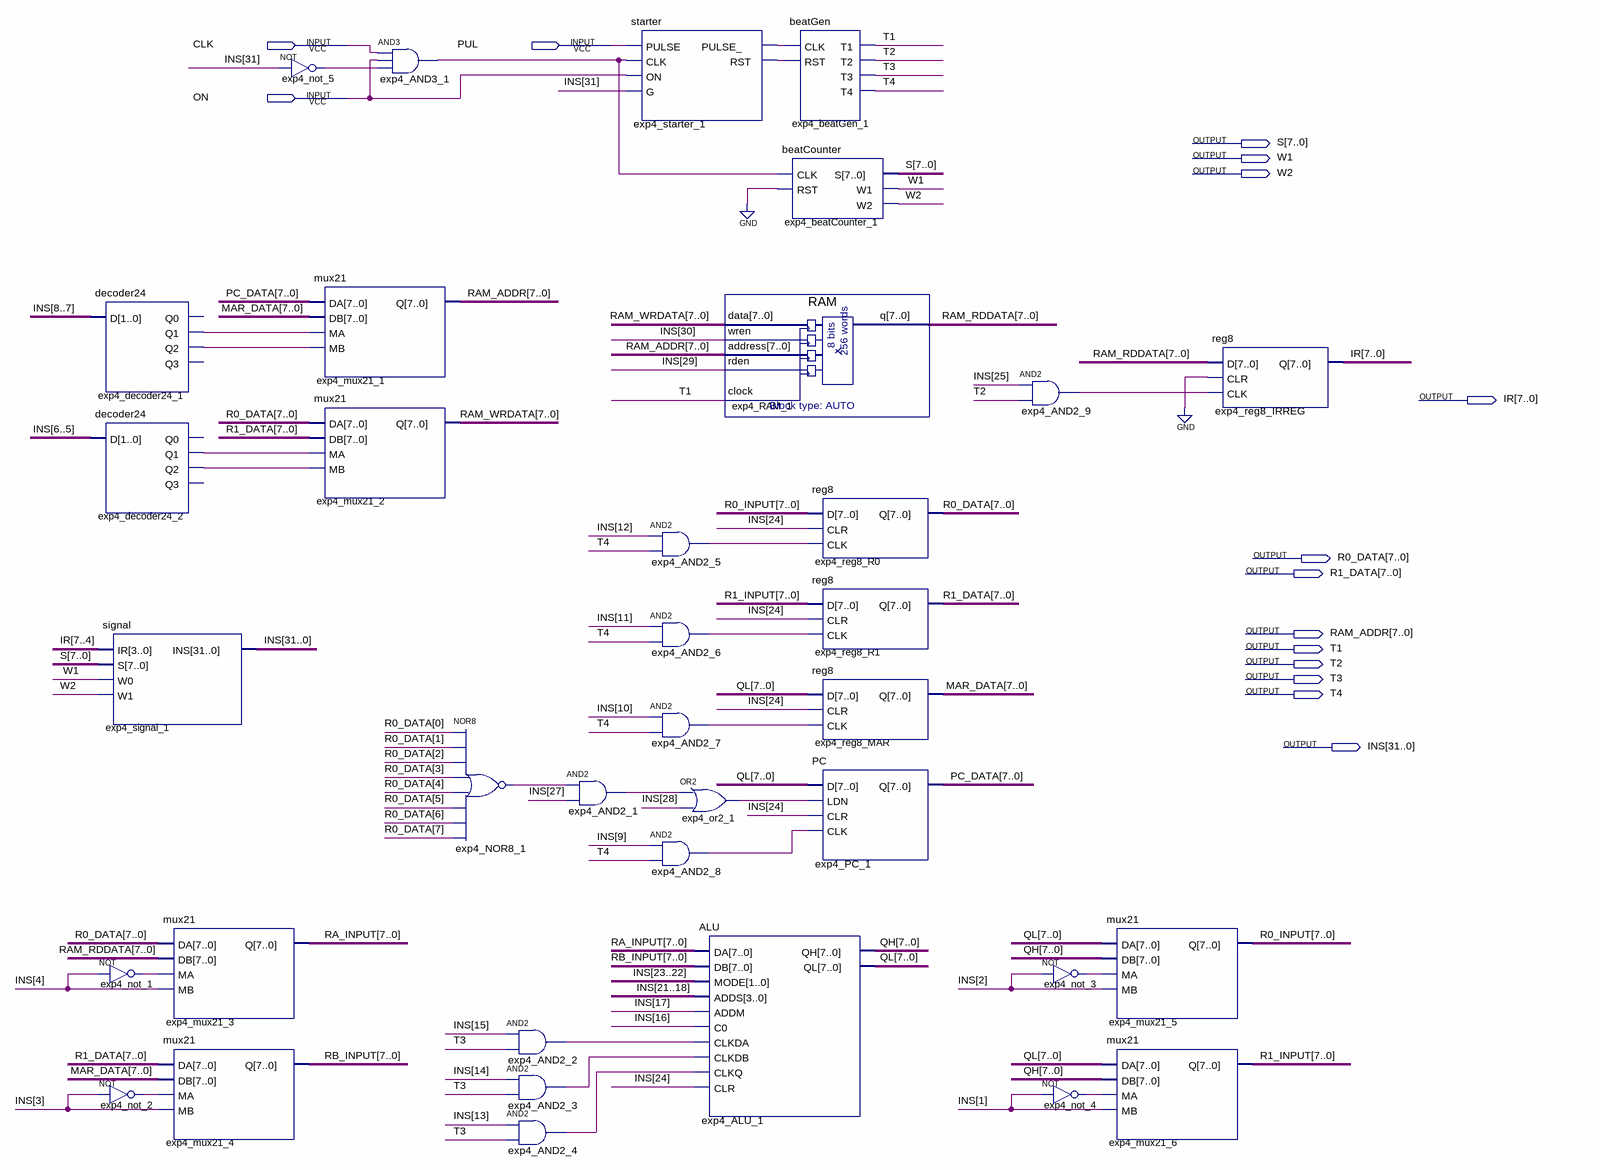
[diagram p0: schematic sheet]
// Quartus schematic exp4.bdf as structural Verilog: 36 symbols, 15 pins
module exp4 (
  input  CLK,
  input  PUL,
  input  ON,
  output [7:0] S,
  output W1,
  output W2,
  output [7:0] IR,
  output [7:0] R0_DATA,
  output [7:0] R1_DATA,
  output [7:0] RAM_ADDR,
  output T1,
  output T2,
  output T3,
  output T4,
  output [31:0] INS
);

  wire exp4_AND2_1_out, exp4_AND2_2_out, exp4_AND2_3_out, exp4_AND2_4_out, exp4_AND2_5_out, exp4_AND2_6_out,
       exp4_AND2_7_out, exp4_AND2_8_out, exp4_AND2_9_out, exp4_AND3_1_out, exp4_decoder24_1_q1,
       exp4_decoder24_1_q2, exp4_decoder24_2_q1, exp4_decoder24_2_q2, exp4_NOR8_1_out, exp4_not_1_out,
       exp4_not_2_out, exp4_not_3_out, exp4_not_4_out, exp4_not_5_out, exp4_or2_1_out, exp4_starter_1_pulse_,
       exp4_starter_1_rst;
  wire [7:0] MAR_DATA, PC_DATA, QH, QL, R0_INPUT, R1_INPUT, RA_INPUT, RAM_RDDATA, RAM_WRDATA, RB_INPUT;

  decoder24 exp4_decoder24_1 (.D(INS[8:7]), .Q1(exp4_decoder24_1_q1), .Q2(exp4_decoder24_1_q2));  // open: Q0, Q3
  decoder24 exp4_decoder24_2 (.D(INS[6:5]), .Q1(exp4_decoder24_2_q1), .Q2(exp4_decoder24_2_q2));  // open: Q0, Q3
  signal exp4_signal_1 (.IR(IR[7:4]), .S(S), .W0(W1), .W1(W2), .INS(INS));
  not exp4_not_1 (exp4_not_1_out, INS[4]);
  not exp4_not_2 (exp4_not_2_out, INS[3]);
  mux21 exp4_mux21_3 (.DA(R0_DATA), .DB(RAM_RDDATA), .MA(exp4_not_1_out), .MB(INS[4]), .Q(RA_INPUT));
  mux21 exp4_mux21_4 (.DA(R1_DATA), .DB(MAR_DATA), .MA(exp4_not_2_out), .MB(INS[3]), .Q(RB_INPUT));
  not exp4_not_5 (exp4_not_5_out, INS[31]);
  mux21 exp4_mux21_1 (.DA(PC_DATA), .DB(MAR_DATA), .MA(exp4_decoder24_1_q1), .MB(exp4_decoder24_1_q2), .Q(RAM_ADDR));
  mux21 exp4_mux21_2 (.DA(R0_DATA), .DB(R1_DATA), .MA(exp4_decoder24_2_q1), .MB(exp4_decoder24_2_q2), .Q(RAM_WRDATA));
  and exp4_AND3_1 (exp4_AND3_1_out, CLK, ON, exp4_not_5_out);
  nor exp4_NOR8_1 (exp4_NOR8_1_out, R0_DATA[0], R0_DATA[1], R0_DATA[2], R0_DATA[3], R0_DATA[4], R0_DATA[5], R0_DATA[6], R0_DATA[7]);
  and exp4_AND2_2 (exp4_AND2_2_out, INS[15], T3);
  and exp4_AND2_3 (exp4_AND2_3_out, INS[14], T3);
  and exp4_AND2_4 (exp4_AND2_4_out, INS[13], T3);
  and exp4_AND2_1 (exp4_AND2_1_out, exp4_NOR8_1_out, INS[27]);
  starter exp4_starter_1 (
    .PULSE(PUL), .CLK(exp4_AND3_1_out), .ON(ON), .G(INS[31]), .PULSE_(exp4_starter_1_pulse_),
    .RST(exp4_starter_1_rst));
  and exp4_AND2_5 (exp4_AND2_5_out, INS[12], T4);
  and exp4_AND2_6 (exp4_AND2_6_out, INS[11], T4);
  and exp4_AND2_7 (exp4_AND2_7_out, INS[10], T4);
  or exp4_or2_1 (exp4_or2_1_out, exp4_AND2_1_out, INS[28]);
  and exp4_AND2_8 (exp4_AND2_8_out, INS[9], T4);
  RAM exp4_RAM_1 (.data(RAM_WRDATA), .wren(INS[30]), .address(RAM_ADDR), .rden(INS[29]), .clock(T1), .q(RAM_RDDATA));
  ALU exp4_ALU_1 (
    .DA(RA_INPUT), .DB(RB_INPUT), .MODE(INS[23:22]), .ADDS(INS[21:18]), .ADDM(INS[17]), .C0(INS[16]),
    .CLKDA(exp4_AND2_2_out), .CLKDB(exp4_AND2_3_out), .CLKQ(exp4_AND2_4_out), .CLR(INS[24]), .QH(QH), .QL(QL));
  beatGen exp4_beatGen_1 (.CLK(exp4_starter_1_pulse_), .RST(exp4_starter_1_rst), .T1(T1), .T2(T2), .T3(T3), .T4(T4));
  beatCounter exp4_beatCounter_1 (.CLK(exp4_AND3_1_out), .RST(1'b0), .S(S), .W1(W1), .W2(W2));
  reg8 exp4_reg8_R0 (.D(R0_INPUT), .CLR(INS[24]), .CLK(exp4_AND2_5_out), .Q(R0_DATA));
  reg8 exp4_reg8_R1 (.D(R1_INPUT), .CLR(INS[24]), .CLK(exp4_AND2_6_out), .Q(R1_DATA));
  reg8 exp4_reg8_MAR (.D(QL), .CLR(INS[24]), .CLK(exp4_AND2_7_out), .Q(MAR_DATA));
  PC exp4_PC_1 (.D(QL), .LDN(exp4_or2_1_out), .CLR(INS[24]), .CLK(exp4_AND2_8_out), .Q(PC_DATA));
  and exp4_AND2_9 (exp4_AND2_9_out, INS[25], T2);
  not exp4_not_3 (exp4_not_3_out, INS[2]);
  not exp4_not_4 (exp4_not_4_out, INS[1]);
  mux21 exp4_mux21_5 (.DA(QL), .DB(QH), .MA(exp4_not_3_out), .MB(INS[2]), .Q(R0_INPUT));
  mux21 exp4_mux21_6 (.DA(QL), .DB(QH), .MA(exp4_not_4_out), .MB(INS[1]), .Q(R1_INPUT));
  reg8 exp4_reg8_IRREG (.D(RAM_RDDATA), .CLR(1'b0), .CLK(exp4_AND2_9_out), .Q(IR));
endmodule
